# EAGLE design Zio Qwiic IR Thermometer MLX90614 (EAGLE 9.1.1)
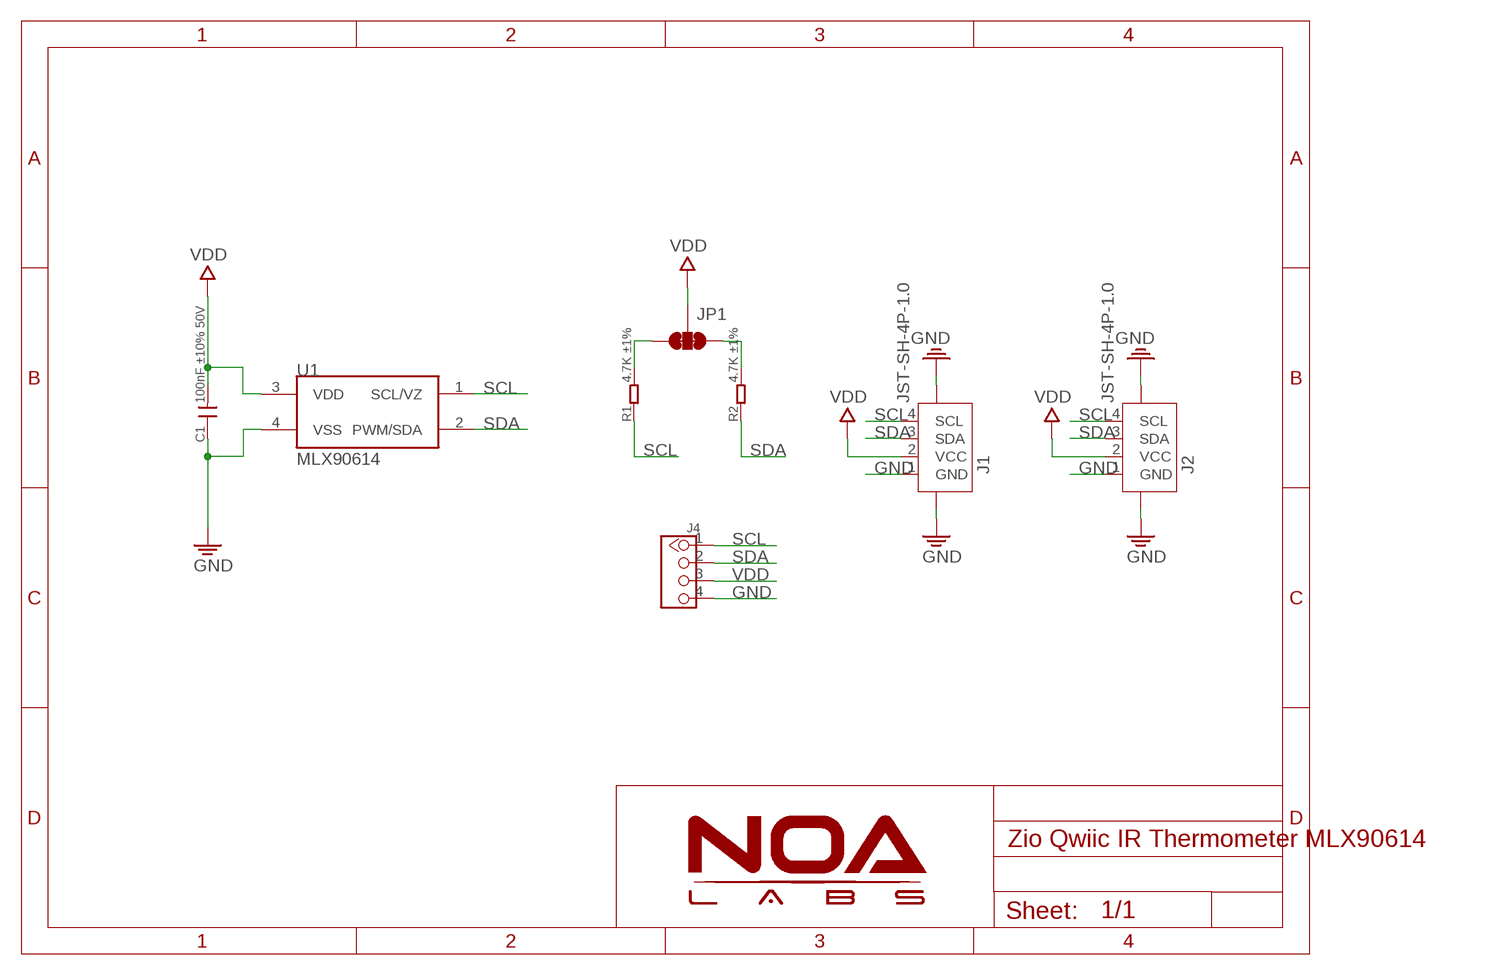
[diagram p0: schematic, sheet 1]

## Parts
C1  100nF ±10% 50V  C-0603  [C0603]
J1  JST-SH-4P-1.0  [JST-SH-4P]
J2  JST-SH-4P-1.0  [JST-SH-4P]
J4  HEADER-4P-60/35MIL  [4P-65/35MIL]
JP1  SMT-JUMPER_3_2-NC_TRACE  [SMT-JUMPER_3_2-NC_TRACE]
R1  4.7K ±1%  R-0603  [R0603]
R2  4.7K ±1%  R-0603  [R0603]
U1  MLX90614  [TO-39]

## Nets
GND: C1.1 J1.1(GND) J1.NC1 J1.NC2 J2.1(GND) J2.NC1 J2.NC2 J4.4 U1.4(VSS)
N$6: JP1.3 R1.2
N$8: JP1.1 R2.2
SCL: J1.4(SCL) J2.4(SCL) J4.1 R1.1 U1.1(SCL/VZ)
SDA: J1.3(SDA) J2.3(SDA) J4.2 R2.1 U1.2(PWM/SDA)
VDD: C1.2 J1.2(VCC) J2.2(VCC) J4.3 JP1.2 U1.3(VDD)

## Library data of the parts
C1 = RCL:C
J1 J2 = Connector:JST-SH-4P
J4 = Connector:HEADER-4P
JP1 = NOA-Jumpers:SMT-JUMPER_3_2-NC_TRACE
R1 R2 = RCL:R
U1 = IC:MLX90614

## Board
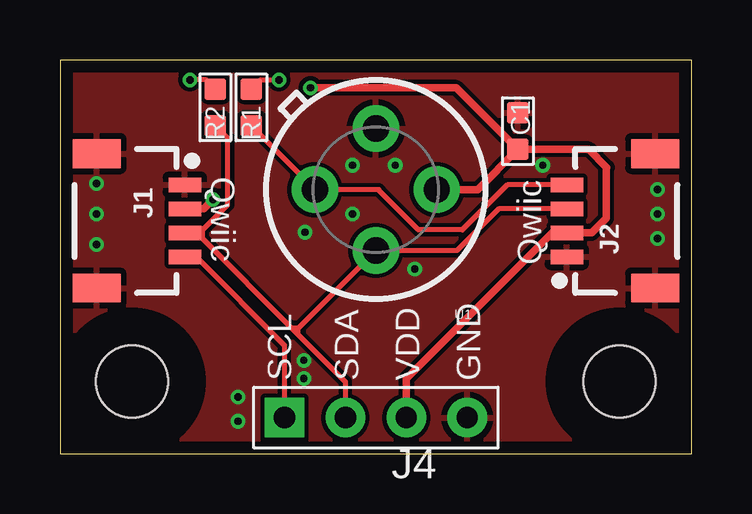
[diagram p1: board, top side]
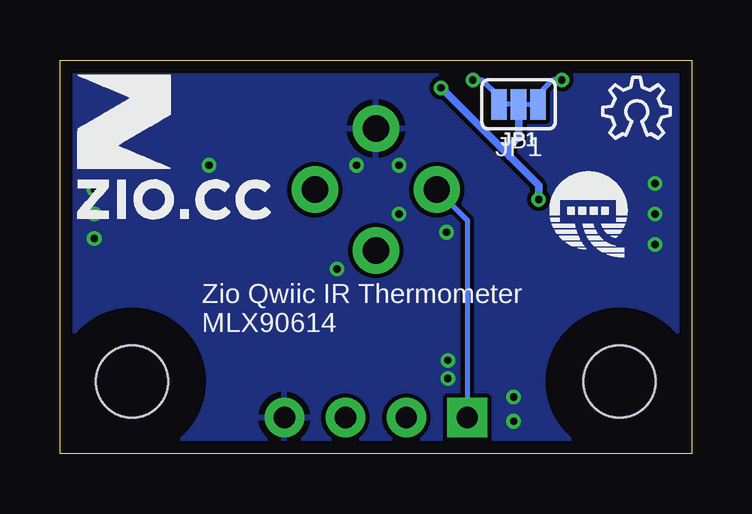
[diagram p2: board, bottom side, seen from below]

Size 26.32 x 16.4 mm. Coordinates in mm from the lower left corner, seen from the top.
Outline: 0,0 26.32,0 26.32,16.4 0,16.4 0,0
Copper layers (1*16): Top 0.035mm / dielectric 1.5mm / Bottom 0.035mm
Design rules "NOA Eagle Rule": minimum track width 7mil, minimum drill 12mil, track to track 7mil, track to pad 7mil, pad to pad 7mil, via to via 7mil, smd to smd 0mil, copper to edge 20mil, drill to drill 10mil, minimum pad ring 10mil, minimum via ring 6mil, stop-mask expansion 2mil, vias tented up to drill 25mil, thermal gap 10mil
Holes 3 mm at 3,3 23.32,3
tRestrict: area 20.3,0 to 26.3,6; area 0,0 to 6,6
bRestrict: area 0,0 to 6,6; area 20.3,0 to 26.3,6

### Footprints (pad centres in the part's own frame; a part is rotated, then mirrored left to right if it is on the bottom)
C0603 = smd 0.889 x 0.889: 1 -0.762,0; 2 0.762,0
JST-SH-4P = smd 0.6 x 1.35: 1 1.5,0; 2 0.5,0; 3 -0.5,0; 4 -1.5,0 | smd 1.2 x 2: NC1 -2.8,3.675; NC2 2.8,3.675
4P-65/35MIL = drill 0.889 pad 1.651 square: 1 0,3.81 | drill 0.889 pad 1.651: 2 0,1.27; 3 0,-1.27; 4 0,-3.81
SMT-JUMPER_3_2-NC_TRACE = smd 0.635 x 1.27: 1 -0.813,0; 2 0,0; 3 0.813,0
R0603 = smd 0.889 x 0.889: 1 -0.762,0; 2 0.762,0
TO-39 = drill 1.1 pad 1.93: 1 2.54,0; 2 0,2.54; 3 -2.54,0; 4 0,-2.54

### Placement (x,y rotation side)
C1  19.08,13.44 270 top
J1  5.2,9.7 90 top
J2  21.12,9.7 270 top
J4  13.16,1.5 90 top
JP1  7.21,14.55 180 bottom
R1  7.98,14.43 90 top
R2  6.48,14.43 90 top
U1  13.16,11 180 top
U$2  [6MM]  25.63,9.78 0 bottom
U$3  [OSHW_6X100_NOTEXT]  3.71,13.13 0 bottom
U$4  [QWIIC-LOGO-BASIC]  4.34,9.96 0 bottom

### Tracks (layer width: path | path; a pad name or v marks a point on that pad's centre or on a via)
GND  (via drill 0.3)
  other vias: 10.21,9.22 14.78,7.7 20.12,12.01 10.16,3.89 10.16,3.12 24.89,11 24.89,9.98 24.89,8.97 1.52,11.25 1.52,9.98 1.52,8.71 12.19,12.01 13.97,12.01 12.19,9.98 7.42,2.36 7.42,1.35
  pour Bottom: 0,16.41 26.31,16.41 26.31,0 0,0
  pour Top: 0,16.41 26.31,16.41 26.31,0 0,0
N$6  (via drill 0.3)
  Top 0.203: R1.2 8.36,15.57 v9.12,15.57
  Bottom 0.203: 8.03,14.94 8.1,14.94 8.74,15.57 | JP1.3 8.03,14.86 8.74,15.57 | v9.12,15.57 8.74,15.57
N$8  (via drill 0.3)
  Top 0.203: R2.2 6.1,15.57 v5.41,15.57
  Bottom 0.203: v5.41,15.57 5.79,15.57 5.97,15.39 | 6.4,14.96 6.4,14.94 | 5.97,15.39 6.4,14.96 | JP1.1 6.4,14.96 | 6.4,14.96 5.97,15.39
SCL
  Top 0.203: J1.4 5.67,8.2 9.35,4.52 J4.1 | J2.4 18.64,11.2 16.76,9.32 14.94,9.32 13.31,10.95 13.31,10.97 13.28,11 U1.1 10.62,11.02 R1.1
  Bottom 0.203: U1.1 9.35,9.73 J4.1
SDA
  Top 0.203: J1.3 5.68,9.2 5.92,8.97 | J4.2 11.89,2.99 9.91,4.98 | 5.92,8.97 9.65,5.23 | 9.65,5.23 9.91,4.98 | 9.93,5.23 U1.2 16.54,8.46 18.28,10.2 J2.3 | 9.93,5.23 9.65,5.23 | 9.93,5.23 9.91,5.21 9.91,4.98 | R2.1 6.99,13.16 6.99,10.36 6.13,9.51 6.02,9.4 | 6.02,9.4 5.93,9.31 | 5.93,9.31 5.82,9.2 J1.3 | 5.93,9.31 5.92,9.3 5.92,8.97 | J1.3 5.4,9.4 6.02,9.4
VDD  (via drill 0.3)
  Top 0.305: C1.2 22.02,12.68 22.78,11.91 22.76,11.89 22.76,9.8 22.15,9.2 J2.2 20.5,9.2 14.43,3.13 J4.3 | C1.2 17.4,11 U1.3 | C1.2 16.51,15.24 v10.44,15.24 | J1.2 5.98,10.2 v6.38,10.59
  Bottom 0.305: v10.44,15.24 8,12.8 | 8,12.8 7.8,12.6 | 7.8,12.6 7.58,12.38 | 7.58,12.38 6.38,11.18 v6.38,10.59 | JP1.2 7.21,13.18 7.54,12.85 | 7.54,12.85 7.8,12.6 | 7.54,12.85 7.59,12.8 | 7.59,12.8 8,12.8 | 7.59,12.8 7.59,12.39 7.58,12.38

### Text on the board
tPlace: Qwiic | Qwiic | SCL | SDA | VDD | GND
bPlace: JP1 | Zio Qwiic IR Thermometer / MLX90614